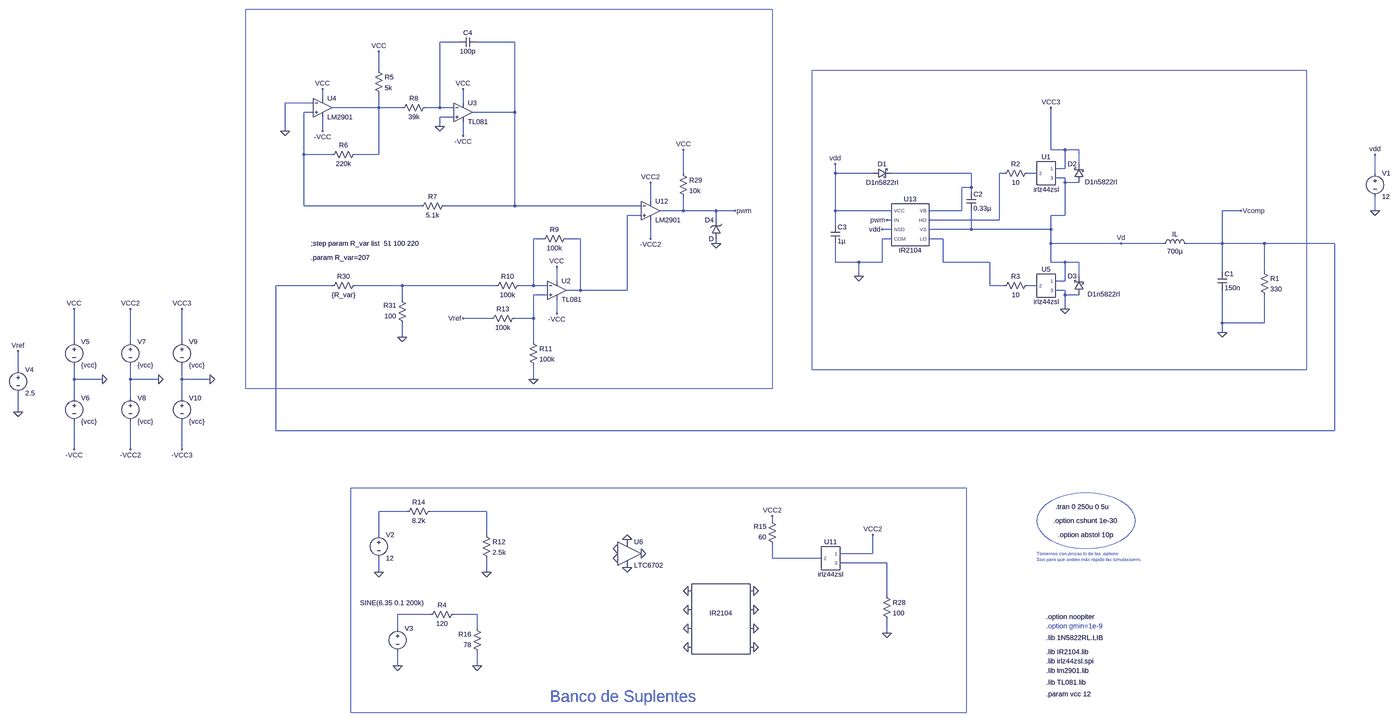
[diagram p0: schematic Buck-lazo-cerrado2.asc, whole sheet]
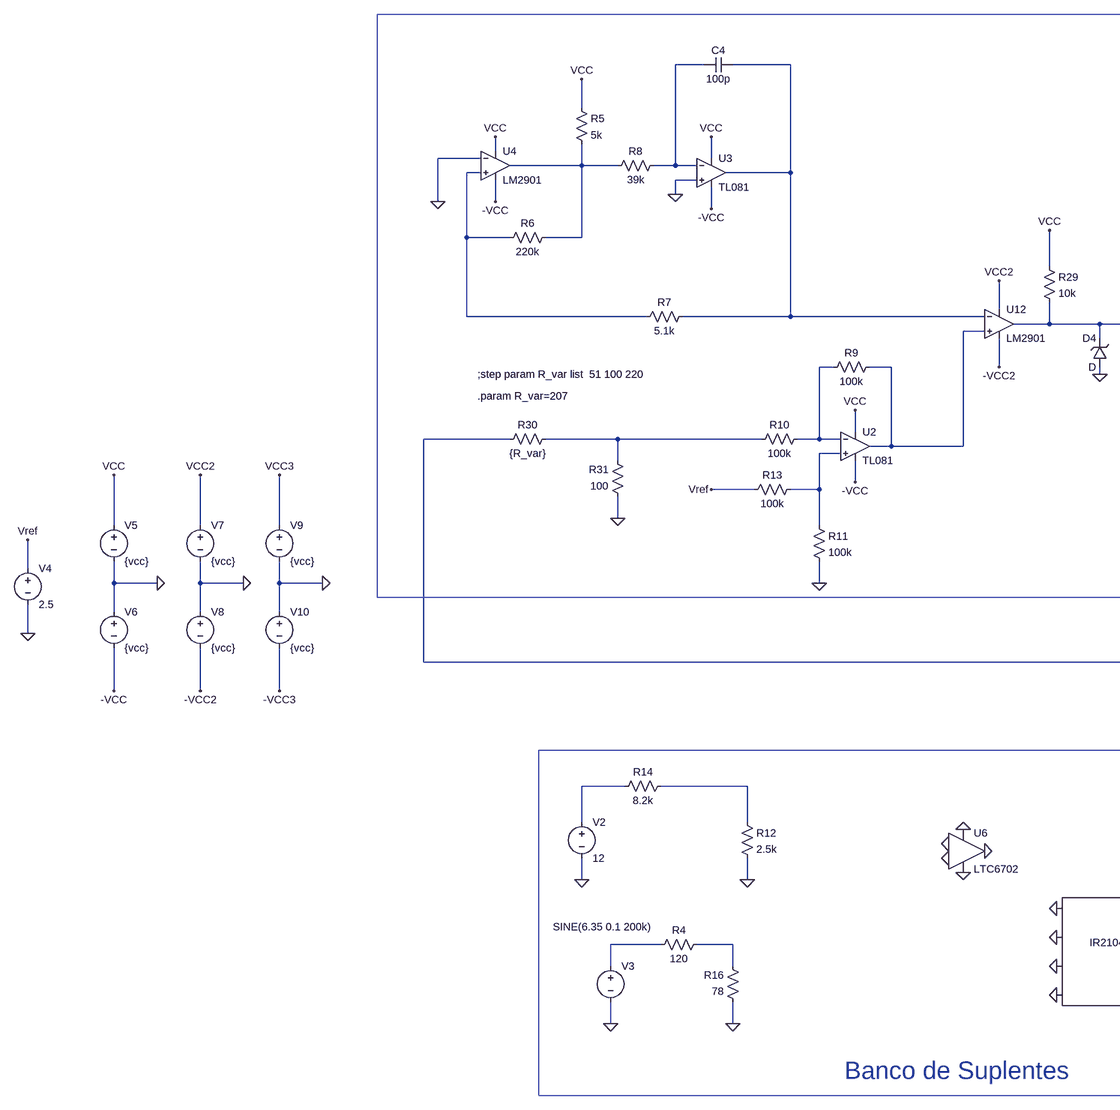
[diagram p1: schematic Buck-lazo-cerrado2.asc, part, row 1 of 1, column 1 of 2]
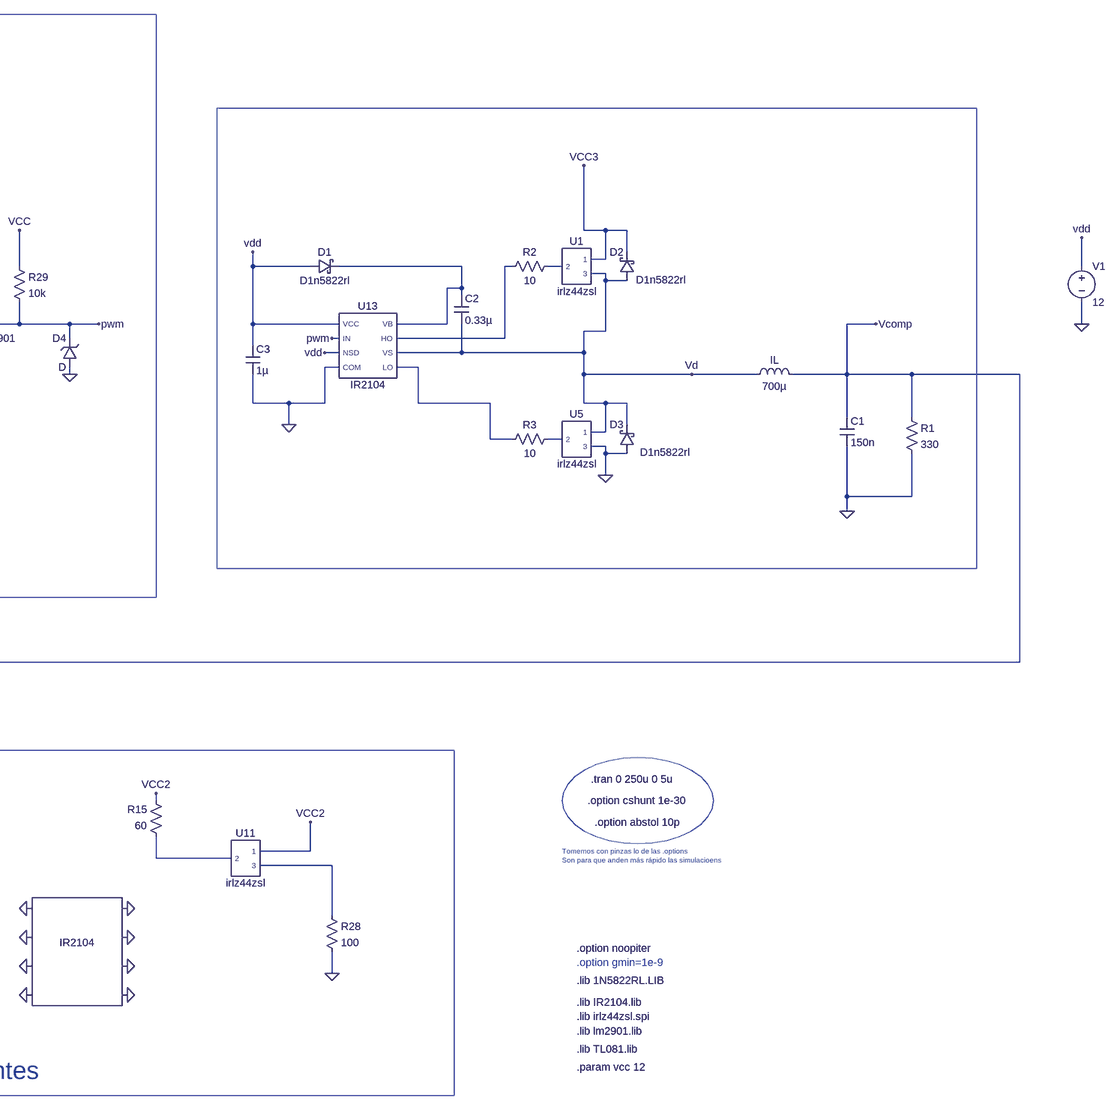
[diagram p2: schematic Buck-lazo-cerrado2.asc, part, row 1 of 1, column 2 of 2]
Buck-lazo-cerrado2.asc, the LTspice schematic file:
Version 4
SHEET 1 3480 1872
WIRE -1904 -1184 -1968 -1184
WIRE -1712 -1184 -1840 -1184
WIRE -2176 -1088 -2176 -1152
WIRE -2368 -992 -2368 -1024
WIRE -2400 -976 -2496 -976
WIRE -1888 -976 -1888 -1024
WIRE -2176 -960 -2176 -1008
WIRE -2176 -960 -2336 -960
WIRE -2096 -960 -2176 -960
WIRE -1968 -960 -1968 -1184
WIRE -1968 -960 -2016 -960
WIRE -1920 -960 -1968 -960
WIRE -2400 -944 -2432 -944
WIRE -1712 -944 -1712 -1184
WIRE -1712 -944 -1856 -944
WIRE -1920 -928 -1968 -928
WIRE -1968 -896 -1968 -928
WIRE -2496 -880 -2496 -976
WIRE -2368 -880 -2368 -928
WIRE -1888 -864 -1888 -912
WIRE 224 -816 224 -960
WIRE 272 -816 224 -816
WIRE 320 -816 272 -816
WIRE -2432 -800 -2432 -944
WIRE -2336 -800 -2432 -800
WIRE -2176 -800 -2176 -960
WIRE -2176 -800 -2256 -800
WIRE 320 -768 320 -816
WIRE 272 -752 272 -816
WIRE 272 -752 240 -752
WIRE -1136 -736 -1136 -816
WIRE -512 -736 -512 -768
WIRE -384 -736 -512 -736
WIRE -48 -736 -320 -736
WIRE 64 -736 48 -736
WIRE 176 -736 144 -736
WIRE 1376 -736 1376 -800
WIRE 272 -720 240 -720
WIRE 272 -704 272 -720
WIRE 320 -704 272 -704
WIRE -48 -688 -48 -736
WIRE -48 -688 -80 -688
WIRE -48 -672 -48 -688
WIRE -1248 -640 -1248 -704
WIRE -2432 -624 -2432 -800
WIRE -2032 -624 -2432 -624
WIRE -1712 -624 -1712 -944
WIRE -1712 -624 -1952 -624
WIRE -1280 -624 -1712 -624
WIRE -1136 -608 -1136 -656
WIRE -1136 -608 -1216 -608
WIRE -1024 -608 -1136 -608
WIRE -960 -608 -1024 -608
WIRE -512 -608 -512 -736
WIRE -320 -608 -512 -608
WIRE -80 -608 -80 -688
WIRE -80 -608 -192 -608
WIRE 880 -608 816 -608
WIRE 1376 -608 1376 -656
WIRE -1280 -592 -1328 -592
WIRE 272 -592 272 -704
WIRE 272 -592 224 -592
WIRE -1024 -576 -1024 -608
WIRE -320 -576 -336 -576
WIRE 48 -576 48 -736
WIRE 48 -576 -192 -576
WIRE -512 -560 -512 -608
WIRE -320 -544 -352 -544
WIRE -48 -544 -48 -608
WIRE -48 -544 -192 -544
WIRE 224 -544 224 -592
WIRE 224 -544 -48 -544
WIRE -1616 -512 -1648 -512
WIRE -1488 -512 -1536 -512
WIRE -1248 -512 -1248 -576
WIRE -320 -512 -352 -512
WIRE -144 -512 -192 -512
WIRE -1024 -496 -1024 -512
WIRE 224 -496 224 -544
WIRE 464 -496 224 -496
WIRE 608 -496 464 -496
WIRE 816 -496 816 -608
WIRE 816 -496 688 -496
WIRE 960 -496 816 -496
WIRE 1200 -496 960 -496
WIRE -512 -432 -512 -496
WIRE -432 -432 -512 -432
WIRE -352 -432 -352 -512
WIRE -352 -432 -432 -432
WIRE -144 -432 -144 -512
WIRE 16 -432 -144 -432
WIRE 224 -432 224 -496
WIRE 272 -432 224 -432
WIRE 320 -432 272 -432
WIRE 816 -400 816 -496
WIRE 960 -400 960 -496
WIRE -432 -384 -432 -432
WIRE 320 -384 320 -432
WIRE -1568 -368 -1568 -416
WIRE 272 -368 272 -432
WIRE 272 -368 240 -368
WIRE -2336 -352 -2528 -352
WIRE -2096 -352 -2256 -352
WIRE -1776 -352 -2096 -352
WIRE -1648 -352 -1648 -512
WIRE -1648 -352 -1696 -352
WIRE -1600 -352 -1648 -352
WIRE 16 -352 16 -432
WIRE 64 -352 16 -352
WIRE 176 -352 144 -352
WIRE -1488 -336 -1488 -512
WIRE -1488 -336 -1536 -336
WIRE -1328 -336 -1328 -592
WIRE -1328 -336 -1488 -336
WIRE 272 -336 240 -336
WIRE -1600 -320 -1648 -320
WIRE 272 -320 272 -336
WIRE 320 -320 272 -320
WIRE -2096 -304 -2096 -352
WIRE 272 -272 272 -320
WIRE -1568 -256 -1568 -304
WIRE -1792 -240 -1888 -240
WIRE -1648 -240 -1648 -320
WIRE -1648 -240 -1712 -240
WIRE 816 -224 816 -336
WIRE 960 -224 960 -320
WIRE 960 -224 816 -224
WIRE 816 -192 816 -224
WIRE -2096 -176 -2096 -224
WIRE -3408 -160 -3408 -272
WIRE -3216 -160 -3216 -272
WIRE -3040 -160 -3040 -272
WIRE -1648 -160 -1648 -240
WIRE -3616 -64 -3616 -128
WIRE -3408 -32 -3408 -80
WIRE -3312 -32 -3408 -32
WIRE -3216 -32 -3216 -80
WIRE -3120 -32 -3216 -32
WIRE -3040 -32 -3040 -80
WIRE -2944 -32 -3040 -32
WIRE -1648 -32 -1648 -80
WIRE -3408 32 -3408 -32
WIRE -3216 32 -3216 -32
WIRE -3040 32 -3040 -32
WIRE -3616 80 -3616 16
WIRE -2528 144 -2528 -352
WIRE 1200 144 1200 -496
WIRE 1200 144 -2528 144
WIRE -3408 208 -3408 112
WIRE -3216 208 -3216 112
WIRE -3040 208 -3040 112
WIRE -2080 768 -2176 768
WIRE -1808 768 -2000 768
WIRE -832 800 -832 784
WIRE -2176 848 -2176 768
WIRE -1808 848 -1808 768
WIRE -384 912 -384 848
WIRE -384 912 -496 912
WIRE -832 928 -832 880
WIRE -560 928 -832 928
WIRE -336 944 -496 944
WIRE -2176 976 -2176 928
WIRE -1808 976 -1808 928
WIRE -336 1056 -336 944
WIRE -2000 1120 -2112 1120
WIRE -1840 1120 -1920 1120
WIRE -2112 1168 -2112 1120
WIRE -1840 1168 -1840 1120
WIRE -336 1184 -336 1136
WIRE -2112 1296 -2112 1248
WIRE -1840 1296 -1840 1248
FLAG 816 -192 0
FLAG 464 -496 Vd
FLAG 1376 -608 0
FLAG 1376 -800 vdd
FLAG 272 -272 0
FLAG 224 -960 VCC3
FLAG -336 -576 pwm
FLAG -432 -384 0
FLAG -512 -768 vdd
FLAG -352 -544 vdd
FLAG -2496 -880 0
FLAG -1968 -896 0
FLAG -2176 -1152 VCC
FLAG -2368 -1024 VCC
FLAG -2368 -880 -VCC
FLAG -1888 -1024 VCC
FLAG -1888 -864 -VCC
FLAG -1248 -704 VCC2
FLAG -1248 -512 -VCC2
FLAG -1648 -32 0
FLAG -1568 -416 VCC
FLAG -1568 -256 -VCC
FLAG -1888 -240 Vref
FLAG -1808 976 0
FLAG -1024 -496 0
FLAG -3616 80 0
FLAG -3312 -32 0
FLAG -3616 -128 Vref
FLAG -3408 208 -VCC
FLAG -3408 -272 VCC
FLAG 880 -608 Vcomp
FLAG -2176 976 0
FLAG -2112 1296 0
FLAG -1840 1296 0
FLAG -3120 -32 0
FLAG -3216 208 -VCC2
FLAG -3216 -272 VCC2
FLAG -2944 -32 0
FLAG -3040 208 -VCC3
FLAG -3040 -272 VCC3
FLAG -960 -608 pwm
FLAG -832 784 VCC2
FLAG -336 1184 0
FLAG -384 848 VCC2
FLAG -1360 896 0
FLAG -1328 864 0
FLAG -1280 912 0
FLAG -1360 928 0
FLAG -1328 960 0
FLAG -896 1232 0
FLAG -896 1168 0
FLAG -896 1104 0
FLAG -896 1040 0
FLAG -1120 1040 0
FLAG -1120 1104 0
FLAG -1120 1232 0
FLAG -1120 1168 0
FLAG -1136 -816 VCC
FLAG -2096 -176 0
SYMBOL ind 592 -480 R270
WINDOW 0 32 56 VTop 2
WINDOW 3 5 56 VBottom 2
SYMATTR InstName IL
SYMATTR Value 700µ
SYMBOL cap 800 -400 R0
SYMATTR InstName C1
SYMATTR Value 150n
SYMBOL res 944 -416 R0
SYMATTR InstName R1
SYMATTR Value 330
SYMBOL voltage 1376 -752 R0
WINDOW 123 0 0 Left 0
WINDOW 39 0 0 Left 0
SYMATTR InstName V1
SYMATTR Value 12
SYMBOL res 160 -752 R90
WINDOW 0 0 56 VBottom 2
WINDOW 3 32 56 VTop 2
SYMATTR InstName R2
SYMATTR Value 10
SYMBOL cap -64 -672 R0
SYMATTR InstName C2
SYMATTR Value 0.33µ
SYMBOL schottky -384 -720 R270
WINDOW 0 32 32 VTop 2
WINDOW 3 0 32 VBottom 2
SYMATTR InstName D1
SYMATTR Value D1n5822rl
SYMATTR Description Diode
SYMATTR Type diode
SYMBOL cap -528 -560 R0
SYMATTR InstName C3
SYMATTR Value 1µ
SYMBOL res 160 -368 R90
WINDOW 0 0 56 VBottom 2
WINDOW 3 32 56 VTop 2
SYMATTR InstName R3
SYMATTR Value 10
SYMBOL schottky 336 -704 R180
WINDOW 0 24 64 Left 2
WINDOW 3 -4 2 Right 2
SYMATTR InstName D2
SYMATTR Value D1n5822rl
SYMATTR Description Diode
SYMATTR Type diode
SYMBOL schottky 336 -320 R180
WINDOW 0 24 64 Left 2
WINDOW 3 -125 3 Left 2
SYMATTR InstName D3
SYMATTR Value D1n5822rl
SYMATTR Description Diode
SYMATTR Type diode
SYMBOL OpAmps\\opamp2 -2368 -1024 R0
SYMATTR InstName U4
SYMATTR Value LM2901
SYMBOL res -2192 -1104 R0
SYMATTR InstName R5
SYMATTR Value 5k
SYMBOL res -2240 -816 R90
WINDOW 0 0 56 VBottom 2
WINDOW 3 32 56 VTop 2
SYMATTR InstName R6
SYMATTR Value 220k
SYMBOL res -1936 -640 R90
WINDOW 0 0 56 VBottom 2
WINDOW 3 32 56 VTop 2
SYMATTR InstName R7
SYMATTR Value 5.1k
SYMBOL res -2000 -976 R90
WINDOW 0 0 56 VBottom 2
WINDOW 3 32 56 VTop 2
SYMATTR InstName R8
SYMATTR Value 39k
SYMBOL cap -1840 -1200 R90
WINDOW 0 0 32 VBottom 2
WINDOW 3 32 32 VTop 2
SYMATTR InstName C4
SYMATTR Value 100p
SYMBOL res -1520 -528 R90
WINDOW 0 0 56 VBottom 2
WINDOW 3 32 56 VTop 2
SYMATTR InstName R9
SYMATTR Value 100k
SYMBOL res -1680 -368 R90
WINDOW 0 0 56 VBottom 2
WINDOW 3 32 56 VTop 2
SYMATTR InstName R10
SYMATTR Value 100k
SYMBOL res -1664 -176 R0
SYMATTR InstName R11
SYMATTR Value 100k
SYMBOL res -1824 832 R0
SYMATTR InstName R12
SYMATTR Value 2.5k
SYMBOL res -1696 -256 R90
WINDOW 0 0 56 VBottom 2
WINDOW 3 32 56 VTop 2
SYMATTR InstName R13
SYMATTR Value 100k
SYMBOL res -1984 752 R90
WINDOW 0 0 56 VBottom 2
WINDOW 3 32 56 VTop 2
SYMATTR InstName R14
SYMATTR Value 8.2k
SYMBOL zener -1008 -512 R180
WINDOW 0 24 64 Left 2
WINDOW 3 24 0 Left 2
SYMATTR InstName D4
SYMATTR Description Diode
SYMATTR Type diode
SYMBOL voltage -3616 -80 R0
WINDOW 123 0 0 Left 0
WINDOW 39 0 0 Left 0
SYMATTR InstName V4
SYMATTR Value 2.5
SYMBOL voltage -3408 -176 R0
WINDOW 123 0 0 Left 0
WINDOW 39 0 0 Left 0
SYMATTR InstName V5
SYMATTR Value {vcc}
SYMBOL voltage -3408 16 R0
WINDOW 123 0 0 Left 0
WINDOW 39 0 0 Left 0
SYMATTR InstName V6
SYMATTR Value {vcc}
SYMBOL voltage -2176 832 R0
WINDOW 123 0 0 Left 0
WINDOW 39 0 0 Left 0
SYMATTR InstName V2
SYMATTR Value 12
SYMBOL Misc\\DIP8 -1008 1136 R0
WINDOW 3 0 0 Invisible 0
SYMATTR Value IR2104
SYMATTR InstName IR2104
SYMBOL TL081 -1568 -400 R0
SYMATTR InstName U2
SYMBOL TL081 -1888 -1008 R0
SYMATTR InstName U3
SYMBOL AutoGenerated\\irlz44zsl 208 -736 R0
SYMATTR InstName U1
SYMBOL AutoGenerated\\irlz44zsl 208 -352 R0
SYMATTR InstName U5
SYMBOL voltage -2112 1152 R0
WINDOW 123 0 0 Left 0
WINDOW 39 0 0 Left 0
WINDOW 3 -128 -71 Left 2
SYMATTR Value SINE(6.35 0.1 200k)
SYMATTR InstName V3
SYMBOL res -1904 1104 R90
WINDOW 0 0 56 VBottom 2
WINDOW 3 32 56 VTop 2
SYMATTR InstName R4
SYMATTR Value 120
SYMBOL res -1824 1264 R180
WINDOW 0 36 76 Left 2
WINDOW 3 36 40 Left 2
SYMATTR InstName R16
SYMATTR Value 78
SYMBOL voltage -3216 -176 R0
WINDOW 123 0 0 Left 0
WINDOW 39 0 0 Left 0
SYMATTR InstName V7
SYMATTR Value {vcc}
SYMBOL voltage -3216 16 R0
WINDOW 123 0 0 Left 0
WINDOW 39 0 0 Left 0
SYMATTR InstName V8
SYMATTR Value {vcc}
SYMBOL voltage -3040 -176 R0
WINDOW 123 0 0 Left 0
WINDOW 39 0 0 Left 0
SYMATTR InstName V9
SYMATTR Value {vcc}
SYMBOL voltage -3040 16 R0
WINDOW 123 0 0 Left 0
WINDOW 39 0 0 Left 0
SYMATTR InstName V10
SYMATTR Value {vcc}
SYMBOL res -816 896 R180
WINDOW 0 36 76 Left 2
WINDOW 3 36 40 Left 2
SYMATTR InstName R15
SYMATTR Value 60
SYMBOL AutoGenerated\\irlz44zsl -528 928 R0
SYMATTR InstName U11
SYMBOL res -352 1040 R0
SYMATTR InstName R28
SYMATTR Value 100
SYMBOL Comparators\\LTC6702 -1328 912 R0
SYMATTR InstName U6
SYMBOL IR2104 -256 -560 R0
SYMATTR InstName U13
SYMBOL OpAmps\\opamp2 -1248 -672 R0
SYMATTR InstName U12
SYMATTR Value LM2901
SYMBOL res -1152 -752 R0
SYMATTR InstName R29
SYMATTR Value 10k
SYMBOL res -2240 -368 R90
WINDOW 0 0 56 VBottom 2
WINDOW 3 32 56 VTop 2
SYMATTR InstName R30
SYMATTR Value {R_var}
SYMBOL res -2080 -208 R180
WINDOW 0 36 76 Left 2
WINDOW 3 36 40 Left 2
SYMATTR InstName R31
SYMATTR Value 100
TEXT 208 1248 Left 2 !.lib IR2104.lib
TEXT 208 1200 Left 2 !.lib 1N5822RL.LIB
TEXT 208 1128 Left 2 !.option noopiter
TEXT 208 1160 Left 2 ;.option gmin=1e-9
TEXT 208 1280 Left 2 !.lib irlz44zsl.spi
TEXT 208 1392 Left 2 !.param vcc 12
TEXT 208 1312 Left 2 !.lib lm2901.lib
TEXT 208 1352 Left 2 !.lib TL081.lib
TEXT -1592 1400 Left 5 ;Banco de Suplentes
TEXT 240 752 Left 2 !.tran 0 250u 0 5u
TEXT 232 800 Left 2 !.option cshunt 1e-30
TEXT 248 848 Left 2 !.option abstol 10p
TEXT 176 912 Left 1 ;Tomemos con pinzas lo de las .options\nSon para que anden más rápido las simulacioens
TEXT -2408 -448 Left 2 !.param R_var=207
TEXT -2408 -496 Left 2 !;step param R_var list  51 100 220
RECTANGLE Normal -64 1456 -2272 688
RECTANGLE Normal -2704 -1296 -832 0
RECTANGLE Normal 1104 -64 -592 -1088
CIRCLE Normal 512 896 176 704

The netlist it stands for:
* Buck-lazo-cerrado2.asc
L§IL Vd Vcomp 700µ
C1 Vcomp 0 150n
R1 Vcomp 0 330
V1 vdd 0 12
R2 N007 N006 10
C2 N005 Vd 0.33µ
D1 vdd N005 D1n5822rl
C3 vdd 0 1µ
R3 N012 N010 10
D2 Vd VCC3 D1n5822rl
D3 0 Vd D1n5822rl
XU4 N004 0 VCC -VCC N003 LM2901  ; pins In+ In- V+ V- OUT
R5 VCC N003 5k
R6 N003 N004 220k
R7 N002 N004 5.1k
R8 N001 N003 39k
C4 N002 N001 100p
R9 N008 N009 100k
R10 N009 N011 100k
R11 N013 0 100k
R12 N015 0 2.5k
R13 N013 Vref 100k
R14 N015 N014 8.2k
D4 0 pwm D
V4 Vref 0 2.5
V5 VCC 0 {vcc}
V6 0 -VCC {vcc}
V2 N014 0 12
XIR2104 0 0 0 0 0 0 0 0 IR2104
* U2: TL081 (symbol TL081 not available, pins judged from their places): In+=N013 In-=N009 V+=VCC V-=-VCC OUT=N008
* U3: TL081 (symbol TL081 not available, pins judged from their places): In+=0 In-=N001 V+=VCC V-=-VCC OUT=N002
XU1 VCC3 N007 Vd irlz44zsl  ; pins 1 2 3
XU5 Vd N012 0 irlz44zsl  ; pins 1 2 3
V3 N018 0 SINE(6.35 0.1 200k)
R4 N019 N018 120
R16 0 N019 78
V7 VCC2 0 {vcc}
V8 0 -VCC2 {vcc}
V9 VCC3 0 {vcc}
V10 0 -VCC3 {vcc}
R15 N016 VCC2 60
XU11 VCC2 N016 N017 irlz44zsl  ; pins 1 2 3
R28 N017 0 100
XU6 0 0 0 0 0 LTC6702
XU13 N010 N006 0 pwm vdd N005 Vd vdd IR2104  ; pins LO HO COM IN VCC VB VS NSD
XU12 N008 N002 VCC2 -VCC2 pwm LM2901  ; pins In+ In- V+ V- OUT
R29 VCC pwm 10k
R30 N011 Vcomp {R_var}
R31 0 N011 100
.model D D
.lib standard.dio
.lib IR2104.lib
.lib 1N5822RL.LIB
.option noopiter
* .option gmin=1e-9
.lib irlz44zsl.spi
.param vcc 12
.lib lm2901.lib
.lib TL081.lib
* Banco de Suplentes
.tran 0 250u 0 5u
.option cshunt 1e-30
.option abstol 10p
* Tomemos con pinzas lo de las .options
* Son para que anden más rápido las simulacioens
.param R_var=207
;step param R_var list  51 100 220
.lib C:\users\Denise.Viltes\OneDrive - Toyota Argentina S.A\Documentos\dce-g5-proyecto_integrador-main\dce-g5-proyecto_integrador\Checkpoint 5\irlz44zsl.spi
.lib LTC3.lib
.lib C:\Users\---\Desktop\DCE\dce-g5-proyecto_integrador\Checkpoint 5\Buck_lazo_cerrado\IR2104.lib
.backanno
.end